# Altium schematic sheet PSAT.SchDoc
size 381 x 241 mm; SheetNumber: 1; SheetTotal: 1
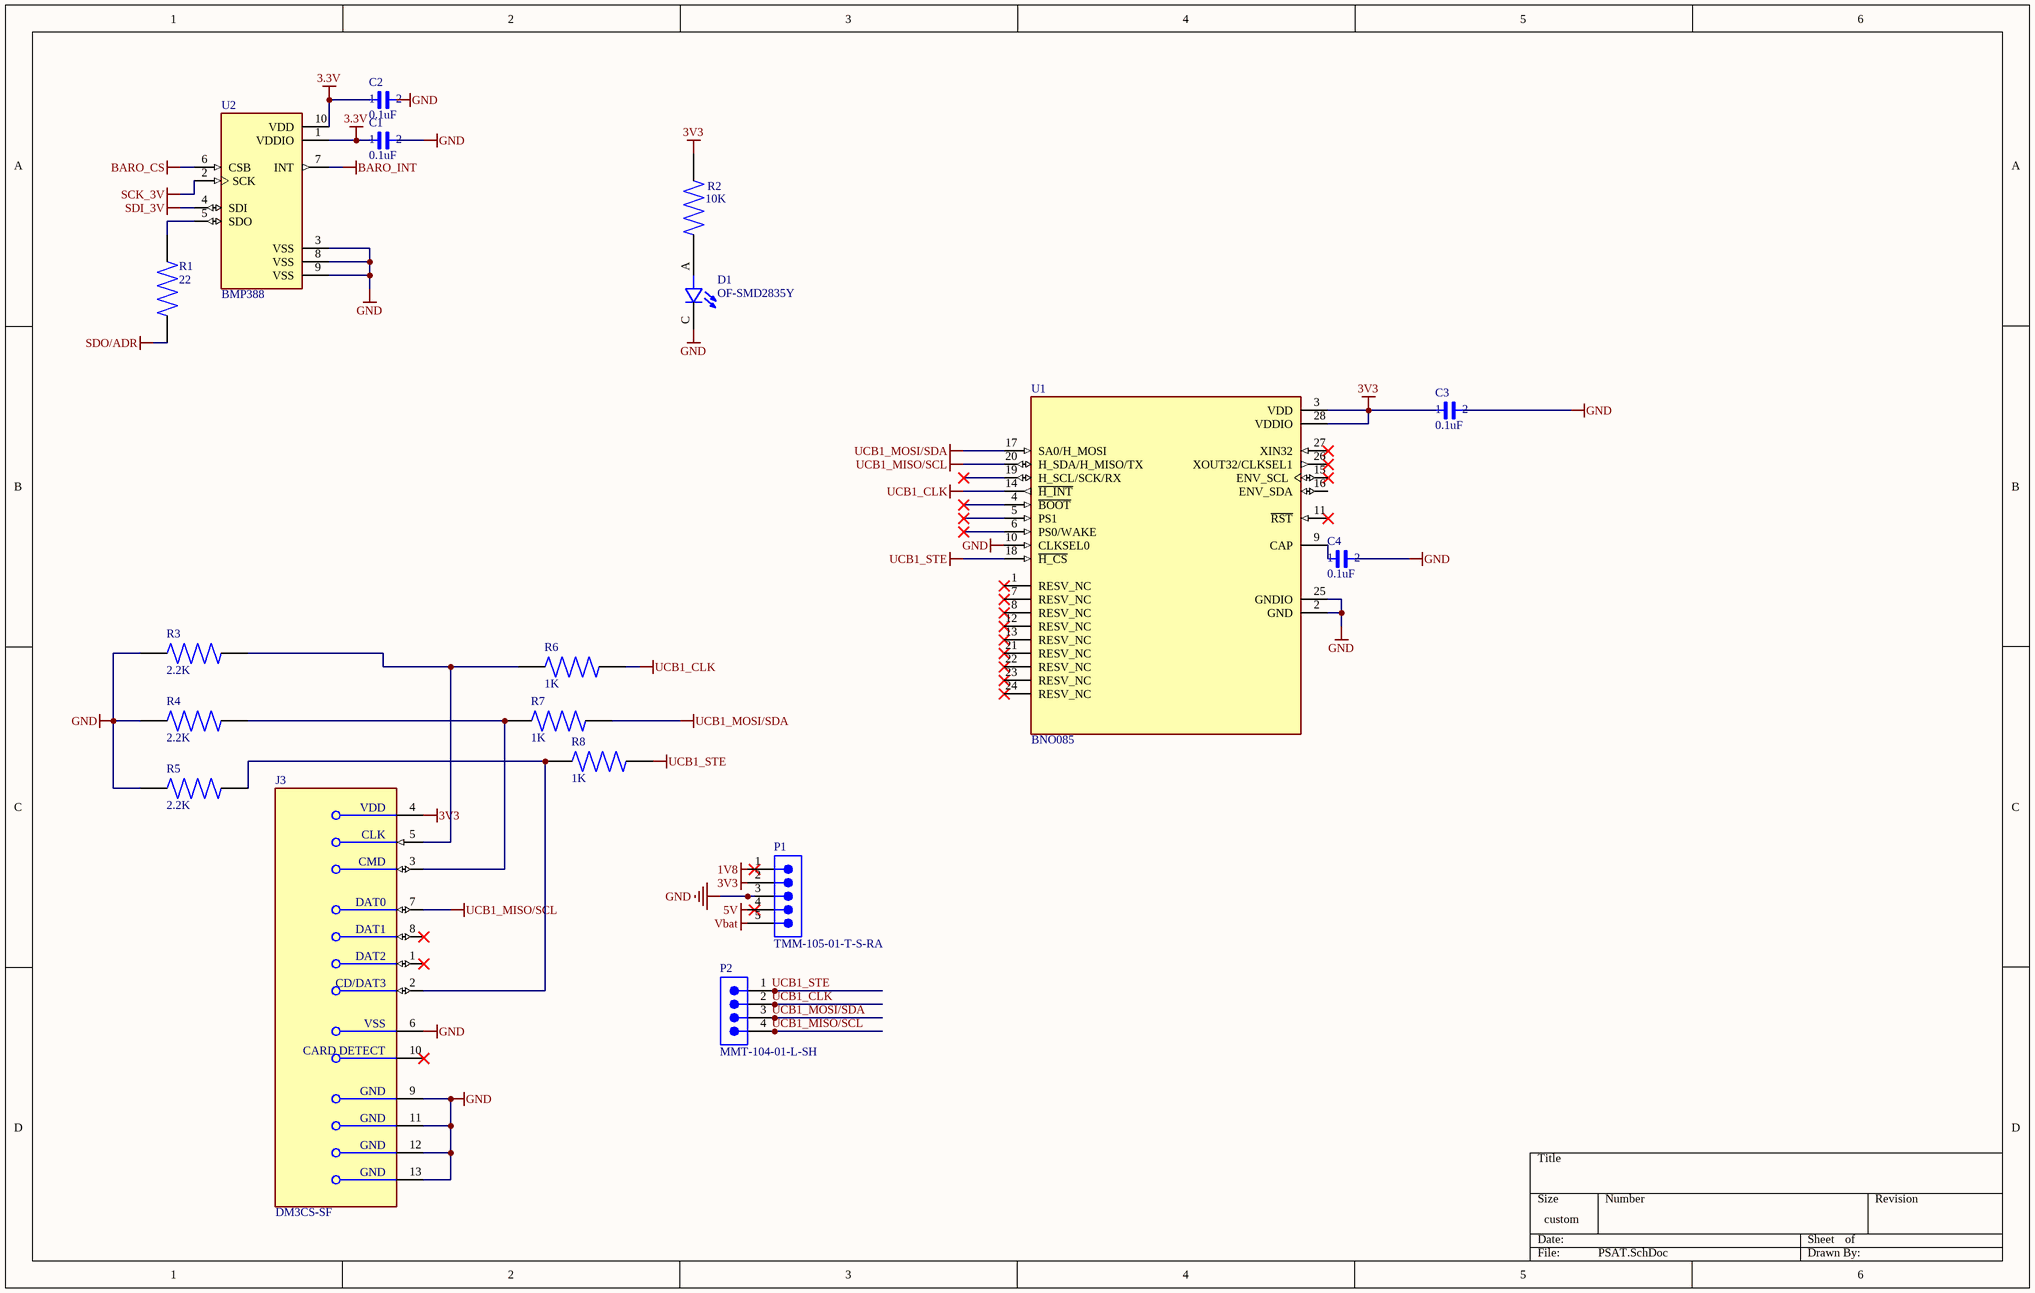
[diagram p0: PSAT.SchDoc]

## Parts
C1  0.1uF  [0603]
C2  0.1uF  [0603]
C3  0.1uF  [0603]
C4  0.1uF  [0603]
D1  OF-SMD2835Y  [LED_OF-SMD2835Y]
J3  DM3CS-SF  [FP-DM3CS-SF-MFG]
P1  TMM-105-01-T-S-RA  [SMTC-TMM-105-01-X-S-RA]
P2  MMT-104-01-L-SH  [SMTC-MMT-104-01-X-SH]
R1  22  [RESC1607X60N]
R2  10K  [RESC1607X60N]
R3  2.2K  [RESC1607X60N]
R4  2.2K  [RESC1607X60N]
R5  2.2K  [RESC1607X60N]
R6  1K  [RESC1607X60N]
R7  1K  [RESC1607X60N]
R8  1K  [RESC1607X60N]
U1  BNO085  [IC_BNO085]
U2  BMP388  [PQFN50P200X200X80-10N]

## Nets
3.3V: C1.1 C2.1 U2.1(VDDIO) U2.10(VDD)
3V3: C3.1 J3.4(VDD) R2.2 U1.3(VDD) U1.28(VDDIO)
BARO_CS: U2.6(CSB)
BARO_INT: U2.7(INT)
GND: C1.2 C2.2 C3.2 C4.2 D1.C J3.6(VSS) J3.9(GND) J3.11(GND) J3.12(GND) J3.13(GND) P1.3 R3.2 R4.2 R5.2 U1.2(GND) U1.10(CLKSEL0) U1.25(GNDIO) U2.3(VSS) U2.8(VSS) U2.9(VSS)
SCK_3V: U2.2(SCK)
SDI_3V: U2.4(SDI)
SDO/ADR: R1.1
UCB1_CLK: P2.2 R6.1 U1.14(~{H_INT})
UCB1_MISO/SCL: J3.7(DAT0) P2.4 U1.20(H_SDA/H_MISO/TX)
UCB1_MOSI/SDA: P2.3 R7.1 U1.17(SA0/H_MOSI)
UCB1_STE: P2.1 R8.1 U1.18(~{H_CS})
NetC4_1: C4.1 U1.9(CAP)
NetD1_A: D1.A R2.1
NetJ3_2: J3.2(CD/DAT3) R5.1 R8.2
NetJ3_3: J3.3(CMD) R4.1 R7.2
NetJ3_5: J3.5(CLK) R3.1 R6.2
NetR1_2: R1.2 U2.5(SDO)

Not connected (* = marked no-connect by the designer): J3 1(DAT2)* 8(DAT1)* 10(CARD_DETECT)*; P1 1 2 4 5; U1 1(RESV_NC)* 4(~{BOOT})* 5(PS1)* 6(PS0/WAKE)* 7(RESV_NC)* 8(RESV_NC)* 11(~{RST})* 12(RESV_NC)* 13(RESV_NC)* 15(ENV_SCL)* 16(ENV_SDA) 19(H_SCL/SCK/RX)* 21(RESV_NC)* 22(RESV_NC)* 23(RESV_NC)* 24(RESV_NC)* 26(XOUT32/CLKSEL1)* 27(XIN32)*

## Notes on the sheet
- Labels drawn without touching a wire or pin: 1V8, 3V3, 5V, Vbat

## Library data of the parts
C1-C4 = C0603: 0 Ohms Jumper 0.1W, 1/10W Chip Resistor 0603 (1608 Metric) Moisture Resistant Thick Film; MF: Yageo; SnapEDA_Link: https://www.snapeda.com/parts/C0603/Yageo/view-part/?ref=snap; Package: 0603 General Cable; Value: *; MP: C0603; Check_prices: https://www.snapeda.com/parts/C0603/Yageo/view-part/?ref=eda
D1 = OF-SMD2835Y: LED; SMD; 2835, PLCC2; yellow; 2200-2800mcd; 2.8x3.5x0.75mm; 120Â°; Availability: Unavailable; MP: OF-SMD2835Y; Value: *; Package: None; Price: None
J3 = CMP-11597-000003-1: CONN MICRO SD CARD HINGED TYPE; Pitch: 1.1mm; Connector Type: Connector; Current Rating: 500mA; Voltage Rating (AC): 125V; Gender: Female; Insulation Resistance: 1GR; Number of Positions: 8; Contact Resistance: 100mR; Packaging: Tape and Reel; Flammability Rating: UL94 V-0; Lead Free: Lead Free; Min Operating Temperature: -25°C; Orientation: Right Angle; Width: 13.8mm; Number of Rows: 1; Housing Material: Polymer; Package Quantity: 1; Mount: Surface Mount; Max Current Rating: 500mA; Radiation Hardening: No; Max Operating Temperature: 85°C; Contact Plating: Gold; Depth: 1.83mm; Contact Material: Gold; Length: 14.1mm; Number of Contacts: 8; Termination: Solder
P1 = CMP-1029-00184-1: Low Profile Through-Hole Header, Right Angle, -55 to 105 degC, 2 mm Pitch, 5-Pin, Male, RoHS; Manufacturer: Samtec; Pitch: 2 mm; PartNumber: TMM-105-01-T-S-RA; PackageReference: TMM-105-01-X-S-RA; DatasheetVersion: F-214; ComponentLink3Description: Package Specification; Temperature Range: -55 to 105 degC; PackageDescription: 2 mm Terminal Strip Assembly (R/A); ComponentLink2Description: Datasheet; RoHS: True; ComponentLink3URL: http://www.samtec.com/documents/webfiles/cpdf/TMM-1XX-XX-XX-X-RA-XXX-MKT.pdf; PackageVersion: V, 3/2013; Mounting Technology: Through-hole; ComponentLink1Description: Manufacturer URL; ComponentLink1URL: http://www.samtec.com; ComponentLink2URL: http://d2a072wq521u33.cloudfront.net/catalog_english//TMM_TH.PDF; Orientation: Right Angle
P2 = CMP-1029-00050-1: Horizontal Surface Mount Header, -55 to 125 degC, 2 mm Pitch, 4-Pin, Male, RoHS; Manufacturer: Samtec; Pitch: 2 mm; ComponentLink2Description: Datasheet; Temperature Range: -55 to 125 degC; DatasheetVersion: F-214; ComponentLink1Description: Manufacturer URL; ComponentLink3URL: http://www.samtec.com/documents/webfiles/cpdf/MMT-1XX-XX-XX-XX-XX-XXX-X-XX-MKT.pdf; ComponentLink3Description: Package Specification; PartNumber: MMT-104-01-L-SH; RoHS: True; PackageDescription: 2mm Horizontal Terminal Surface Mount Strip ASSEM; Orientation: Horizontal; PackageVersion: CY, 12/2000; Mounting Technology: Surface Mount; ComponentLink2URL: http://d2a072wq521u33.cloudfront.net/catalog_english//MMT_SM.PDF; ComponentLink1URL: http://www.samtec.com; PackageReference: MMT-104-01-X-SH
R1-R8 = RC0603JR-070RL: 0 Ohms Jumper 0.1W, 1/10W Chip Resistor 0603 (1608 Metric) Moisture Resistant Thick Film; MF: Yageo; SnapEDA_Link: https://www.snapeda.com/parts/RC0603JR-070RL/Yageo/view-part/?ref=snap; Package: 0603 Yageo; Value: *; MP: RC0603JR-070RL; Check_prices: https://www.snapeda.com/parts/RC0603JR-070RL/Yageo/view-part/?ref=eda
U1 = BNO085: Accelerometer, Gyroscope, Magnetometer, 9 Axis Sensor IÂ²C, SPI, UART Output; MF: Hillcrest Laboratories,; SnapEDA_Link: https://www.snapeda.com/parts/BNO085/Hillcrest+Laboratories%252C+Inc./view-part/?ref=snap; Package: TFLGA-28 Hillcrest Laboratories; Value: *; MP: BNO085; Check_prices: https://www.snapeda.com/parts/BNO085/Hillcrest+Laboratories%252C+Inc./view-part/?ref=eda
U2 = BMP388: P-Sensor SPI I2C 1, 25 Bar SMD; Package: None; Price: None; Value: *; MP: BMP388; Availability: Unavailable